# Altium schematic sheet HTR_Bridge1.SchDoc
size Tabloid
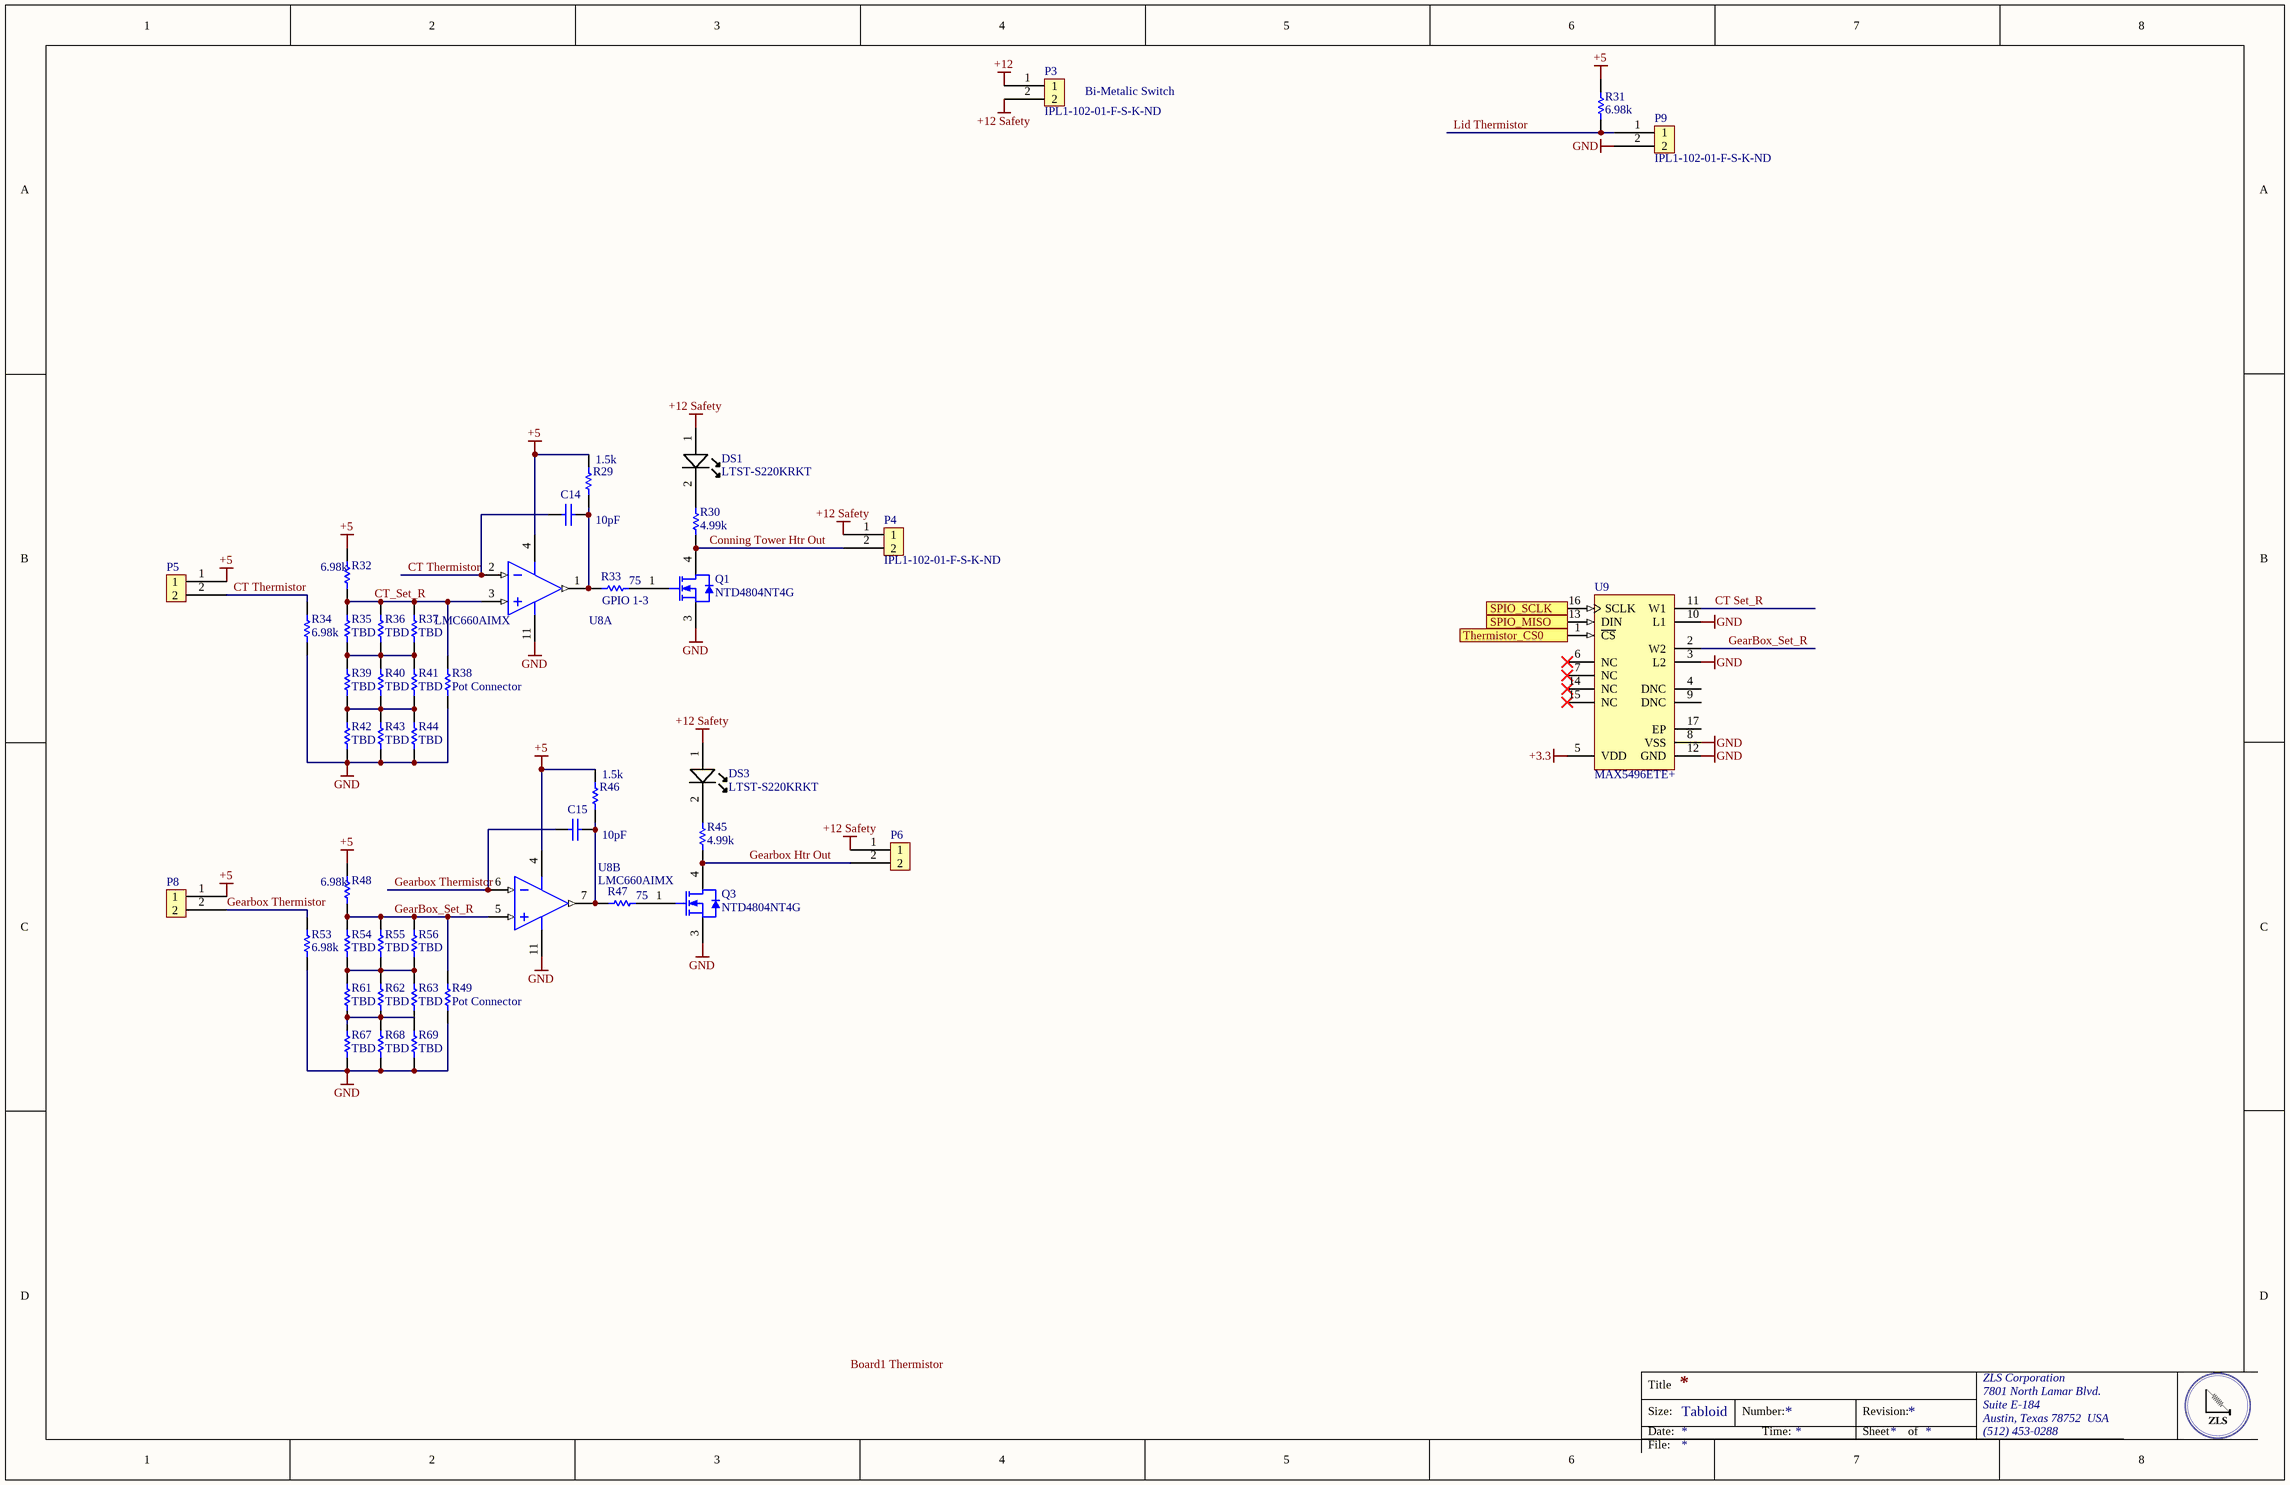
[diagram p0: HTR_Bridge1.SchDoc]

## Parts
C14  Capacitance: 10pF  [CAPC0805(2012)145_N]  (hidden comment: CAP CER 0.1UF 25V X7R 0805)
C15  Capacitance: 10pF  [CAPC0805(2012)145_N]  (hidden comment: CAP CER 0.1UF 25V X7R 0805)
DS1  Manufacturer Part Number: LTST-S220KRKT  [0805C_L]  (hidden comment: Visible Name Value Type    False Description Lite-On LTST-S220KRKT Red LED, 631 nm 2012 (0805) Side View, Rectangle Lens SMD package STRING)
DS3  Manufacturer Part Number: LTST-S220KRKT  [0805C_L]  (hidden comment: Visible Name Value Type    False Description Lite-On LTST-S220KRKT Red LED, 631 nm 2012 (0805) Side View, Rectangle Lens SMD package STRING)
P3  Supplier Part Number 1: IPL1-102-01-F-S-K-ND  [IPL1-102-01-F-S-K]  (hidden comment: IPL1-102-01-F-S-K)
P4  Supplier Part Number 1: IPL1-102-01-F-S-K-ND  [IPL1-102-01-F-S-K]  (hidden comment: IPL1-102-01-F-S-K)
P5  IPL1-102-01-F-S-K  [IPL1-102-01-F-S-K]  (value not drawn)
P6  IPL1-102-01-F-S-K  [IPL1-102-01-F-S-K]  (value not drawn)
P8  IPL1-102-01-F-S-K  [IPL1-102-01-F-S-K]  (value not drawn)
P9  Supplier Part Number 1: IPL1-102-01-F-S-K-ND  [IPL1-102-01-F-S-K]  (hidden comment: IPL1-102-01-F-S-K)
Q1  NTD4804NT4G  [ONSC-DPAK-3-369AA-01_V]
Q3  NTD4804NT4G  [ONSC-DPAK-3-369AA-01_V]
R29  1.5k  [RESC0805(2012)_N]
R30  Resistance (Ohms): 4.99k  [RESC0805(2012)_L]
R31  Resistance (Ohms): 6.98k  [RESC0805(2012)_N]  (hidden comment: 6K98 1% 0805(2012))
R32  Resistance (Ohms): 6.98k  [RESC0805(2012)_N]  (hidden comment: 6K98 1% 0805(2012))
R33  Resistance (Ohms): 75  [RESC0805(2012)_L]
R34  Resistance (Ohms): 6.98k  [RESC0805(2012)_N]  (hidden comment: 6K98 1% 0805(2012))
R35  TBD  [RESC0805(2012)_N]
R36  TBD  [RESC0805(2012)_N]
R37  TBD  [RESC0805(2012)_N]
R38  Pot Connector  [AXIAL-0.3]
R39  TBD  [RESC0805(2012)_N]
R40  TBD  [RESC0805(2012)_N]
R41  TBD  [RESC0805(2012)_N]
R42  TBD  [RESC0805(2012)_N]
R43  TBD  [RESC0805(2012)_N]
R44  TBD  [RESC0805(2012)_N]
R45  Resistance (Ohms): 4.99k  [RESC0805(2012)_L]
R46  1.5k  [RESC0805(2012)_N]
R47  Resistance (Ohms): 75  [RESC0805(2012)_L]
R48  Resistance (Ohms): 6.98k  [RESC0805(2012)_N]  (hidden comment: 6K98 1% 0805(2012))
R49  Pot Connector  [AXIAL-0.3]
R53  Resistance (Ohms): 6.98k  [RESC0805(2012)_N]  (hidden comment: 6K98 1% 0805(2012))
R54  TBD  [RESC0805(2012)_N]
R55  TBD  [RESC0805(2012)_N]
R56  TBD  [RESC0805(2012)_N]
R61  TBD  [RESC0805(2012)_N]
R62  TBD  [RESC0805(2012)_N]
R63  TBD  [RESC0805(2012)_N]
R67  TBD  [RESC0805(2012)_N]
R68  TBD  [RESC0805(2012)_N]
R69  TBD  [RESC0805(2012)_N]
U8  LMC660AIMX  [D0014A_N]  (parts A,B of 4)
U9  MAX5496ETE+  [MAXM-T1655+3_M]

## Ports
SPIO_MISO, SPIO_SCLK, Thermistor_CS0

## Nets
+3.3: U9.5(VDD)
+5: P5.1 P8.1 R29.2 R31.1 R32.2 R46.2 R48.2 U8.4(V+)
+12: P3.1
+12 Safety: DS1.1(A) DS3.1(A) P3.2 P4.1 P6.1
GND: P9.2 Q1.3(S) Q3.3(S) R34.1 R38.1 R42.1 R43.1 R44.1 R49.1 R53.1 R67.1 R68.1 R69.1 U8.11(V-) U9.3(L2) U9.8(VSS) U9.10(L1) U9.12(GND)
Conning Tower Htr Out: P4.2 Q1.4(D) R30.2
CT Set_R: U9.11(W1)
CT Thermistor: C14.1 P5.2 R34.2 U8.2(IN1-)
CT_Set_R: R32.1 R35.2 R36.2 R37.2 R38.2 U8.3(IN1+)
Gearbox Htr Out: P6.2 Q3.4(D) R45.2
Gearbox Thermistor: C15.1 P8.2 R53.2 U8.6(IN2-)
GearBox_Set_R: R48.1 R49.2 R54.2 R55.2 R56.2 U8.5(IN2+) U9.2(W2)
Lid Thermistor: P9.1 R31.2
SPIO_MISO: U9.13(DIN) ; port SPIO_MISO
SPIO_SCLK: U9.16(SCLK) ; port SPIO_SCLK
Thermistor_CS0: U9.1(~{CS}) ; port Thermistor_CS0
NetC14_2: C14.2 R29.1 R33.1 U8.1(OUT1)
NetC15_2: C15.2 R46.1 R47.1 U8.7(OUT2)
NetDS1_2: DS1.2(K) R30.1
NetDS3_2: DS3.2(K) R45.1
NetQ1_1: Q1.1(G) R33.2
NetQ3_1: Q3.1(G) R47.2
NetR35_1: R35.1 R36.1 R37.1 R39.2 R40.2 R41.2
NetR39_1: R39.1 R40.1 R41.1 R42.2 R43.2 R44.2
NetR54_1: R54.1 R55.1 R56.1 R61.2 R62.2 R63.2
NetR61_1: R61.1 R67.2 R68.2 R69.2

Not connected (* = marked no-connect by the designer): R62 1; R63 1; U9 4(DNC) 6(NC)* 7(NC)* 9(DNC) 14(NC)* 15(NC)* 17(EP)

## Notes on the sheet
- (near P3) Bi-Metalic Switch
- (near R33) GPIO 1-3
- Labels drawn without touching a wire or pin: Board1 Thermistor
- Title
- Size:
- Date:
- Tabloid
- Number:
- Time:
- Revision:
- Sheet
- of
- ZLS Corporation
- 7801 North Lamar Blvd.
- Suite E-184
- Austin, Texas 78752  USA
- (512) 453-0288
- File:

## Library data of the parts
C14 C15 = CMP-1036-04795-1: Manufacturer: Murata Electronics North America; Manufacturer Part Number: GRM21BR71E104KA01L; Tolerance: ±10%; Supplier 1: Digi-Key; Supplier Part Number 1: 490-1673-6-ND; RoHS: RoHS Compliant; Category: Capacitors; Stock 1: 891652; Pricing 1: 1=0.2, 10=0.145, 100=0.0683, 500=0.04788, 1000=0.03964 (USD); Packaging: Digi-Reel®; Part Status: Active; Voltage - Rated: 25V; Temperature Coefficient: X7R; Operating Temperature: -55°C ~ 125°C; Features: -; Ratings: -; Applications: General Purpose; Mounting Type: Surface Mount, MLCC; Package / Case: 0805 (2012 Metric); Size / Dimension: 0.079" L x 0.049" W (2.00mm x 1.25mm); Height - Seated (Max): -; Thickness (Max): 0.053" (1.35mm); Lead Spacing: -; Lead Style: -; ComponentLink1URL: http://www.murata.com/~/media/webrenewal/support/library/catalog/products/capacitor/mlcc/c02e.ashx; ComponentLink1Description: http://www.murata.com/~/media/webrenewal/support/library/catalog/products/capacitor/mlcc/c02e.ashx
DS1 DS3 = LED A/K: Manufacturer: Vishay / Lite-On; Lens Colour: Colorless; Lens Style: Diffused,Colorless; Viewing Angle: 130°; Luminous Intensity: 54mcd; Forward Current: 20mA; Forward Voltage: 2V; Power Rating: 75mW; Dominant Wavelength: 631nm; Lens Transparency: Clear; Number of Elements: 1; Wavelength: 639nm; Supplier 1: Digi-Key; Supplier Part Number 1: 160-1469-1-ND; Stock 1: 108191; Pricing 1: 1=0.31, 10=0.225, 25=0.1656, 100=0.1183, 250=0.0804, 500=0.071, 1000=0.0556 (USD); Mount: Surface Mount; Case/Package: 0805; Number of Pins: 2; Colour: Red; Case Code (Metric): 2012; Case Code (Imperial): 0805; Min Operating Temperature: -55°C; Max Operating Temperature: 85°C; Packaging: Tape and Reel; Package Quantity: 4000; Illumination Colour: Red; Test Current: 20mA; Power Dissipation: 75mW; Number of LEDs: 1; Length: 2.1mm; Height: 0.6mm; Width: 1mm; Depth: 0.6mm; Radiation Hardening: No; Lead Free: Lead Free; ComponentLink1URL: https://datasheet.ciiva.com/2110/s-110-ltst-s220krkt-2110132.pdf; ComponentLink1Description: https://datasheet.ciiva.com/2110/s-110-ltst-s220krkt-2110132.pdf; ComponentLink2URL: https://datasheet.ciiva.com/2110/s-110-ltst-s220krkt-2110133.pdf; ComponentLink2Description: https://datasheet.ciiva.com/2110/s-110-ltst-s220krkt-2110133.pdf; ComponentLink3URL: https://datasheet.ciiva.com/2110/s-110-ltst-s220krkt-2110134.pdf; ComponentLink3Description: https://datasheet.ciiva.com/2110/s-110-ltst-s220krkt-2110134.pdf; ComponentLink4URL: https://datasheet.ciiva.com/12403/lite-on-ltst-s220krkt-187389-12403798.pdf; ComponentLink4Description: https://datasheet.ciiva.com/12403/lite-on-ltst-s220krkt-187389-12403798.pdf; ComponentLink5URL: https://datasheet.ciiva.com/16345/lite-onltst-s220krkt-16345511.pdf; ComponentLink5Description: https://datasheet.ciiva.com/16345/lite-onltst-s220krkt-16345511.pdf; ComponentLink6URL: https://datasheet.ciiva.com/15118/getdatasheetpartid-225752-15118120.pdf; ComponentLink6Description: https://datasheet.ciiva.com/15118/getdatasheetpartid-225752-15118120.pdf; ComponentLink7URL: https://datasheet.ciiva.com/14633/0900766b80dc0b76-14633737.pdf; ComponentLink7Description: https://datasheet.ciiva.com/14633/0900766b80dc0b76-14633737.pdf; ComponentLink8URL: https://datasheet.ciiva.com/11775/0900766b80dc0b76-11775439.pdf; ComponentLink8Description: https://datasheet.ciiva.com/11775/0900766b80dc0b76-11775439.pdf
P3-P6 P8 P9 = IPL1-102-01-F-S-K: .100 TERMINAL ASSEMBLY; Manufacturer: Samtec Inc.; Connector Type: Header; Pitch - Mating: 0.100" (2.54mm); Number of Positions: 2; Number of Positions Loaded: All; Style: Board to Cable/Wire; Shrouding: Shrouded - 4 Wall; Contact Length - Mating: 0.215" (5.46mm); Contact Length - Post: 0.120" (3.05mm); Material Flammability Rating: UL94 V-0; Voltage Rating: 675VAC, 954VDC; Supplier 1: Digi-Key; Manufacturer Part Number: IPL1-102-01-F-S-K; RoHS: RoHS Compliant; Category: Connectors, Interconnects; Stock 1: 0; Pricing 1: 1=1.69 (USD); Packaging: Tube; Part Status: Active; Contact Type: Male Pin; Number of Rows: 1; Row Spacing - Mating: -; Mounting Type: Through Hole; Termination: Solder; Fastening Type: Locking Ramp; Overall Contact Length: -; Insulation Height: 0.320" (8.13mm); Contact Shape: Square; Contact Finish - Mating: Gold; Contact Finish Thickness - Mating: 3µin (0.08µm); Contact Finish - Post: Tin; Contact Material: Phosphor Bronze; Insulation Material: Liquid Crystal Polymer (LCP); Features: -; Operating Temperature: -55°C ~ 125°C; Ingress Protection: -; Insulation Color: Natural; Current Rating: -; Mated Stacking Heights: -; Contact Finish Thickness - Post: -; Applications: -; ComponentLink1URL: http://suddendocs.samtec.com/prints/ipl1-1xx-xx-xxx-s-xx-x-xx-mkt.pdf; ComponentLink1Description: http://suddendocs.samtec.com/prints/ipl1-1xx-xx-xxx-s-xx-x-xx-mkt.pdf
  P5 P6 P8: Supplier Part Number 1: IPL1-102-01-F-S-K-ND
Q1 Q3 = CMP-1058-00341-1: Power MOSFET, 30 V, 117 A, Single N-Channel, 3-Pin DPAK, Pb-Free, Tape and Reel; Manufacturer: On Semiconductor; Coss Typ (pF): 952; Qrr Typ (nC): 30; VGS Max (V): 20; ID Max (A): 117; Crss Typ (pF): 556; Channel Polarity: N Channel; Ciss Typ (pF): 4490; VGS(th) Max (V): 2.5; ComponentLink2Description: Datasheet; ComponentLink3Description: Package Specification; Mounting Technology: Surface Mount; PackageDescription: 3-Pin Flange Mount, Body 6.54 x 6.095 mm, Pitch 2.29 mm; PackageVersion: Rev. B, 06/2010; PartNumber: NTD4804NT4G; ComponentLink2URL: http://www.onsemi.cn/pub_link/Collateral/NTD4804N-D.PDF; RoHS: Pb-Free; Configuration: Single; DatasheetVersion: Rev. 8; PackageReference: DPAK-3-369AA-01; ComponentLink3URL: http://www.onsemi.cn/pub_link/Collateral/369AA.PDF; ComponentLink1Description: Manufacturer URL; Packing: Tape and Reel; Package Type: DPAK-3; ComponentLink1URL: http://www.onsemi.com/; V(BR)DSS Min (V): 30; Supplier 1: Digi-Key; Supplier Part Number 1: NTD4804NT4GOSDKR-ND
R29 R46 = CMP-1013-00606-1: 6K98 0.125W 1% 0805 (2012 Metric)  SMD
R30 R45 = CMP-1013-00393-1: Manufacturer: Vishay Dale; Manufacturer Part Number: CRCW08054K99FKEA; Tolerance: ±1%; Power (Watts): 0.125W, 1/8W; Temperature Coefficient: ±100ppm/°C; Supplier 1: Digi-Key; Supplier Part Number 1: 541-4.99KCCT-ND; RoHS: RoHS Compliant; Category: Resistors; Stock 1: 93740; Pricing 1: 1=0.1, 10=0.044, 100=0.0178, 1000=0.00802, 2500=0.00696 (USD); Packaging: Cut Tape (CT); Part Status: Active; Composition: Thick Film; Features: Automotive AEC-Q200; Operating Temperature: -55°C ~ 155°C; Package / Case: 0805 (2012 Metric); Supplier Device Package: 0805; Size / Dimension: 0.079" L x 0.049" W (2.00mm x 1.25mm); Height - Seated (Max): 0.020" (0.50mm); Failure Rate: -; ComponentLink1URL: http://www.vishay.com/docs/20035/dcrcwe3.pdf; ComponentLink1Description: http://www.vishay.com/docs/20035/dcrcwe3.pdf
R31 R32 R34 R48 R53 = CMP-1013-00606-1: 6K98 0.125W 1% 0805 (2012 Metric)  SMD; Manufacturer: Vishay Dale; Manufacturer Part Number: CRCW08056K98FKEA; Power (Watts): 0.125W, 1/8W; Temperature Coefficient: ±100ppm/°C; Supplier 1: Digi-Key; Supplier Part Number 1: 541-6.98KCCT-ND; RoHS: RoHS Compliant; Category: Resistors; Stock 1: 34245; Pricing 1: 1=0.1, 10=0.044, 100=0.0178, 1000=0.00802, 2500=0.00696 (USD); Packaging: Cut Tape (CT); Part Status: Active; Tolerance: ±1%; Composition: Thick Film; Features: Automotive AEC-Q200; Operating Temperature: -55°C ~ 155°C; Package / Case: 0805 (2012 Metric); Supplier Device Package: 0805; Size / Dimension: 0.079" L x 0.049" W (2.00mm x 1.25mm); Height - Seated (Max): 0.020" (0.50mm); Failure Rate: -; ComponentLink1URL: http://www.vishay.com/docs/20035/dcrcwe3.pdf; ComponentLink1Description: http://www.vishay.com/docs/20035/dcrcwe3.pdf
R33 R47 = CMP-1013-00393-1: Manufacturer: Vishay Dale; Manufacturer Part Number: CRCW080575R0FKEA; Tolerance: ±1%; Power (Watts): 0.125W, 1/8W; Temperature Coefficient: ±100ppm/°C; Supplier 1: Digi-Key; Supplier Part Number 1: 541-75.0CCT-ND; RoHS: RoHS Compliant; Category: Resistors; Stock 1: 32546; Pricing 1: 1=0.1, 10=0.044, 100=0.0178, 1000=0.00802, 2500=0.00696 (USD); Packaging: Cut Tape (CT); Part Status: Active; Composition: Thick Film; Features: Automotive AEC-Q200; Operating Temperature: -55°C ~ 155°C; Package / Case: 0805 (2012 Metric); Supplier Device Package: 0805; Size / Dimension: 0.079" L x 0.049" W (2.00mm x 1.25mm); Height - Seated (Max): 0.020" (0.50mm); Failure Rate: -; ComponentLink1URL: http://www.vishay.com/docs/20035/dcrcwe3.pdf; ComponentLink1Description: http://www.vishay.com/docs/20035/dcrcwe3.pdf
R35-R37 R39-R44 R54-R56 R61-R63 R67-R69 = CMP-1013-00606-1: 6K98 0.125W 1% 0805 (2012 Metric)  SMD; Manufacturer: Vishay Dale; Power (Watts): 0.125W, 1/8W; Temperature Coefficient: ±100ppm/°C; Supplier 1: Digi-Key; RoHS: RoHS Compliant; Category: Resistors; Stock 1: 34245; Pricing 1: 1=0.1, 10=0.044, 100=0.0178, 1000=0.00802, 2500=0.00696 (USD); Packaging: Cut Tape (CT); Part Status: Active; Resistance (Ohms): TBD; Tolerance: ±1%; Composition: Thick Film; Features: Automotive AEC-Q200; Operating Temperature: -55°C ~ 155°C; Package / Case: 0805 (2012 Metric); Supplier Device Package: 0805; Size / Dimension: 0.079" L x 0.049" W (2.00mm x 1.25mm); Height - Seated (Max): 0.020" (0.50mm); Failure Rate: -; ComponentLink1URL: http://www.vishay.com/docs/20035/dcrcwe3.pdf; ComponentLink1Description: http://www.vishay.com/docs/20035/dcrcwe3.pdf
R38 R49 = Res1: Resistor
U8 = CMP-0055-00899-3: CMOS Quad Operational Amplifier, 14-pin Narrow SOIC; Manufacturer: Texas Instruments; PackageTopMarking: NSUZXYTTE#*LMC660AIM; PowerWise: N; CompType: Amplifiers; RoHS: N; Code_JEDEC: MS-012AB; ComponentLink1Description: Datasheet URL; ComponentLink1URL: http://www.ti.com/general/docs/lit/getliterature.tsp?genericPartNumber=LMC660&fileType=pdf; Code_IPC: SOIC127P600-14; PackageDescription: Molded Package S.O., .150in Wide, 14 Lead; Package Reference: D0014A; PinCount: 14; PartId: 1
U9 = CMP-0023-00245-1: Dual 10k Digital Potentiometer (Voltage Divider) with 3-Wire Serial SPI Control Interface, Non-Volatile, Linear Taper, 1024 Steps, -40 to 85 degC, 16-pin TQFN (T1655+3), Pb-Free; PackageVersion: Rev. Q, 09/2011; Control Interface: 3-Wire Serial SPI; Code_JEDEC: MO220; Features: EEPROM Wiper Memory; ComponentLink1URL: http://www.maximintegrated.com/; DatasheetVersion: Rev. 2; ComponentLink1Description: Manufacturer URL; PartNumber: MAX5496ETE+; ComponentLink2Description: Datasheet; ComponentLink3Description: Package Specification; Applications: Fiber Communications, Power Supply Cal.; ComponentLink3URL: http://pdfserv.maximintegrated.com/package_dwgs/21-0140.PDF; ComponentLink2URL: http://datasheets.maximintegrated.com/en/ds/MAX5494-MAX5499.pdf; Mounting Technology: Surface Mount; PackageReference: T1655+3; PackageDescription: 16-Pin Thin Quad Flatpack, No Leads, Body 5 x 5 mm, Pitch 0.8 mm